# Altium schematic sheet [02]-IC.SchDoc: ENTER SHEET TITLE
size B; Engineer: ENTER ENGINEER NAME; Organization: CUAir; Address1: L3, 12a Rodborough Rd; Address2: Frenchs Forest; Address3: NSW; Address4: Australia 2086; Revision: ENTER REVISION NUMBER; CompetitionYear: 2019; CPN: ENTER CPN; PROJECT: ENTER PROJECT NAME
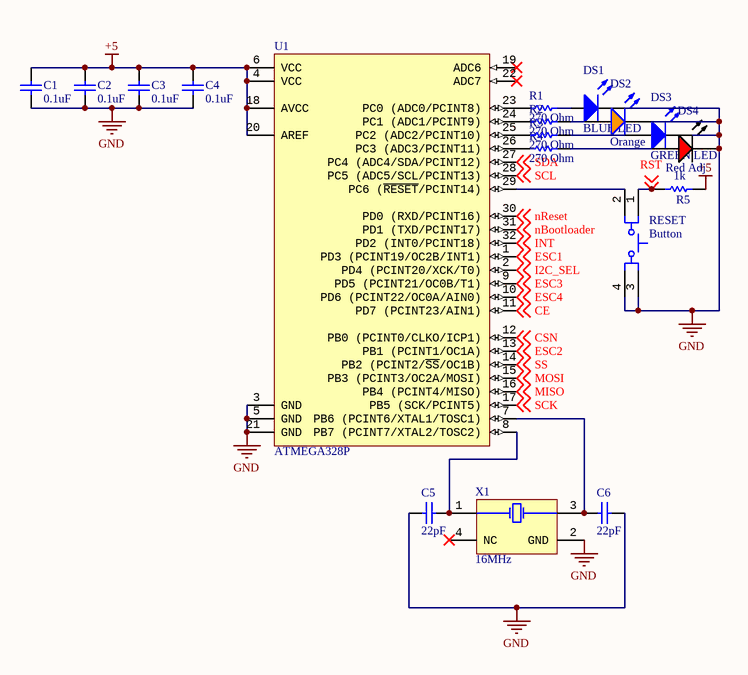
[diagram p0: [02]-IC.SchDoc]

## Parts
C1  0.1uF  [CAPC2013X70X50ML10T25]
C2  0.1uF  [CAPC2013X70X50ML10T25]
C3  0.1uF  [CAPC2013X70X50ML10T25]
C4  0.1uF  [CAPC2013X70X50ML10T25]
C5  22pF  [CAPC1608X90X40ML10T20]
C6  22pF  [CAPC1608X90X40ML10T20]
DS1  BLUE LED  [0805_A]
DS2  Orange  [LTST-C171AKT_V]
DS3  GREEN LED  [LITE-ON-LTST-C191KRKT-2_V]
DS4  Red Adj  [LTST-C170KRKT_V]
R1  270 Ohm  [RESC2013X50X40NL20T20]
R2  270 Ohm  [RESC2013X50X40NL20T20]
R3  270 Ohm  [RESC2013X50X40NL20T20]
R4  270 Ohm  [RESC2013X50X40NL20T20]
R5  1k  [RESC1005X40X25NL05T10]
RESET  Button  [CKCP-PTS645S_V]
U1  ATMEGA328P  [32A_M]
X1  16MHz  [AVX-CX2520DB_V]

## Nets
+5: C1.2 C2.2 C3.2 C4.2 R5.1 U1.4(VCC) U1.6(VCC) U1.18(AVCC) U1.20(AREF)
GND: C1.1 C2.1 C3.1 C4.1 C5.1 C6.2 DS1.1(K) DS2.2(K) DS3.2(K) DS4.2(K) RESET.3 RESET.4 U1.3(GND) U1.5(GND) U1.21(GND) X1.2(GND)
CE: U1.11(PD7_(PCINT23/AIN1)) ; off-sheet CE
CSN: U1.12(PB0_(PCINT0/CLKO/ICP1)) ; off-sheet CSN
ESC1: U1.1(PD3_(PCINT19/OC2B/INT1)) ; off-sheet ESC1
ESC2: U1.13(PB1_(PCINT1/OC1A)) ; off-sheet ESC2
ESC3: U1.9(PD5_(PCINT21/OC0B/T1)) ; off-sheet ESC3
ESC4: U1.10(PD6_(PCINT22/OC0A/AIN0)) ; off-sheet ESC4
I2C_SEL: U1.2(PD4_(PCINT20/XCK/T0)) ; off-sheet I2C_SEL
INT: U1.32(PD2_(INT0/PCINT18)) ; off-sheet INT
MISO: U1.16(PB4_(PCINT4/MISO)) ; off-sheet MISO
MOSI: U1.15(PB3_(PCINT3/OC2A/MOSI)) ; off-sheet MOSI
nBootloader: U1.31(PD1_(TXD/PCINT17)) ; off-sheet nBootloader
nReset: U1.30(PD0_(RXD/PCINT16)) ; off-sheet nReset
RST: R5.2 RESET.1 ; off-sheet RST
SCK: U1.17(PB5_(SCK/PCINT5)) ; off-sheet SCK
SCL: U1.28(PC5_(ADC5/SCL/PCINT13)) ; off-sheet SCL
SDA: U1.27(PC4_(ADC4/SDA/PCINT12)) ; off-sheet SDA
SS: U1.14(PB2_(PCINT2/~{SS}/OC1B)) ; off-sheet SS
NetC5_2: C5.2 U1.8(PB7_(PCINT7/XTAL2/TOSC2)) X1.1(HOT)
NetC6_1: C6.1 U1.7(PB6_(PCINT6/XTAL1/TOSC1)) X1.3(HOT)
NetDS1_2: DS1.2(A) R1.2
NetDS2_1: DS2.1(A) R2.2
NetDS3_1: DS3.1(A) R3.2
NetDS4_1: DS4.1(A) R4.2
NetR1_1: R1.1 U1.23(PC0_(ADC0/PCINT8))
NetR2_1: R2.1 U1.24(PC1_(ADC1/PCINT9))
NetR3_1: R3.1 U1.25(PC2_(ADC2/PCINT10))
NetR4_1: R4.1 U1.26(PC3_(ADC3/PCINT11))
NetRESET_2: RESET.2 U1.29(PC6_(~{RESET}/PCINT14))

Not connected (* = marked no-connect by the designer): U1 19(ADC6)* 22(ADC7)*; X1 4(NC)*

## Notes on the sheet
- Project
- Title
- Size:
- Date:
- B
- Number:
- Revision:
- File:

## Library data of the parts
C1-C4 = CMP-2000-05001-1: Chip Capacitor, 0.1 uF, -20% to 80%, 50 V, -30 to 85 degC, 0805 (2012 Metric), RoHS, Tape and Reel; Manufacturer: Yageo; MPN: CC0805ZRY5V9BB104; Capacitance: 0.1µF; Catalog Drawings: CC_0805_0.6; Featured Product: CommodityMultilayerCeramicCapacitors–CCSeries; Other Names: 311-1361-6; Tolerance: -20%,+80%; Voltage - Rated: 50V; Temperature Coefficient: Y5V(F); Online Catalog: CCSeries; Features: -; Operating Temperature: -30degC~85degC; Packaging: Digi-Reel; Height - Seated (Max): -; Category: Capacitors; Lead Spacing: -; Mounting Type: SurfaceMount,MLCC; Lead Style: -; Datasheet Version: Rev. 5, 07/2010; Series: CC; Manufacturer URL: http://www.yageo.com/; Package Reference: 0805 (2012 Metric); Package Description: 2-Pin Surface Mount Device, Body 2 x 1.25 mm; Ratings: -; Applications: GeneralPurpose; Family: CeramicCapacitors; Package / Case: 0805(2012Metric); Datasheet URL: http://download.siliconexpert.com/pdfs/2012/8/14/1/40/50/201/yageo_/manual/upy-gphc_y5v_6.3v-to-50v_5_revised.pdf; Standard Package: 1; Value: 0.1uF
C5 C6 = CMP-1659-00006-3: Chip Capacitor, 22 pF, +/- 5%, 50 V, -55 to 125 degC, 0603 (1608 Metric), RoHS, Tape and Reel; MPN: CC0603JRNP09BN220; Manufacturer: Yageo; Mount: Surface Mount; PackageReference: 0603; DatasheetVersion: Rev. 13, 05/2016; RoHSCompliant: true; PackageDescription: 2-Pin Surface Mount Device, Body 1.6 x 0.8 mm; Min Operating Temperature: -55 degC; Length: 1.6 mm; Mounting Technology: Surface Mount; Max Operating Temperature: 125 degC; Value: 22pF
DS1 = CMP-1426-00008-1: SMD mono-color Chip LED, WL-SMCW, Blue; Manufacturer: Wuerth Elektronik; PartNumber: 150080BS75000; Color: Blue; ComponentLink2URL: http://katalog.we-online.com/led/datasheet/150080BS75000.pdf; ComponentLink1URL: http://www.we-online.com; ComponentLink2Description: Datasheet; PackageReference: 0805_A; ComponentLink1Description: Manufacturer URL
DS2 = CMP-1674-00004-5: LED Uni-Color Orange, 100 mW, 120 mA, -55 to 85 degC, 2-Pin SMD, RoHS, Tape and Reel; Manufacturer: Lite-On; MPN: LTST-C171AKT; ComponentLink1URL: http://www.us.liteon.com/; ComponentLink2Description: Datasheet; Packaging: Tape and Reel; Mount: Surface Mount; RoHSCompliant: true; Colour: Orange; Min Operating Temperature: -55 degC; ComponentLink2URL: http://optoelectronics.liteon.com/upload/download/DS-22-99-0170/S_110_LTST-C171AKT.pdf; Package Quantity: 3000; Height: 0.8 mm; Max Operating Temperature: 85 degC; ComponentLink1Description: Manufacturer URL; PackageReference: C171AKT; PackageDescription: 2-Pin Surface Mount Device, Body 2 x 1.25 mm; DatasheetVersion: 03/2014; Length: 2 mm; Mounting Technology: Surface Mount; Pins: 2
DS3 = CMP-2000-05198-1: Chip LED, Green, 574 nm, 40 pF, -55 to 85 degC, 2-Pin SMD, RoHS, Tape and Reel; Manufacturer: Lite-On; MPN: LTST-C191KGKT; Rad Hardened: No; Emitting Color: YellowGreen; Product Height (mm): 0.55mm; Forward Voltage: 2.4V; Number of Elements: 1; Dominant Wave Length: 571nm; DELETED: Compliant; Viewing Angle: 130deg; High Brightness: Yes; Peak Wavelength: 574nm; Type: Uni-Color; Forward Current: 30mA; Product Length (mm): 1.6mm; Luminous Intensity: 35mcd; Test Current (It): 20mA; Chip Material: AlGaInP; Product Depth (mm): 0.8mm; Shape Type: Rectangular; Reverse Voltage: 5V; Power Dissipation: 75W; Pin Count: 2; Lens Dimensions: 1.1X0.8X0.37mm; Packaging: TapeandReel; Main Category: ChipLED; Operating Temperature Classification: Industrial; Package Type: ChipLed; Mounting: SurfaceMount; Lum Intensity: 35mcd; Operating Temp Range: -55Cto85C; Datasheet Version: Jan-07; Datasheet URL: http://download.siliconexpert.com/pdfs/2007/08/26/semi_b/manual/lot/ds/ltst-c191kgkt.pdf; Manufacturer URL: http://www.us.liteon.com/
DS4 = CMP-2000-07593-1: LED Red, 75 mW, 54 mcd, -55 to 85 degC, 2-Pin SMD, RoHS, Tape and Reel; Manufacturer: Lite-On; Lens Transparency: Clear; Number of Elements: 1; Power Rating: 75mW; Luminous Intensity: 54mcd; Viewing Angle: 130degrees; Forward Current: 30mA; Wavelength: 639nm; Lens Style: Rectangular; Case\/Package: 0805; Test Current: 20mA; Dominant Wavelength: 631nm; Forward Voltage: 2V; Lens Colour: Colorless; Min Operating Temperature: -55degC; RoHSCompliant: True; Length: 3.2mm; Width: 1.25mm; Mount: SurfaceMount; Packaging: TapeandReel; Number of LEDs: 1; Radiation Hardening: No; Datasheet URL: http://optoelectronics.liteon.com/upload/download/DS-22-99-0150/LTST-C170KRKT.pdf; Datasheet Version: Rev. D, 11/2014; Case Code (Metric): 2012; Height: 1.1mm; Number of Pins: 2; Package Description: 2-Pin Surface Mount Device, Body 2 x 1.25 mm; Manufacturer URL: http://www.us.liteon.com/; Lead Free: LeadFree; Illumination Colour: Red; Colour: Red; Case Code (Imperial): 0805; Max Operating Temperature: 85degC; Power Dissipation: 75mW; Mounting Technology: SurfaceMount; Package Reference: C170KRKT; Package Quantity: 1; Depth: 1.6mm
R1-R4 = CMP-2001-03354-1: 270 Ohm Resistor; Part Number: RR1220P-271-D; Manufacturer: Susumu; Value: 270 Ohm
R5 = CMP-2002-07472-1: MPN: RC0402FR-071KL; Manufacturer: Yageo / Phycomp; Value: 1k
RESET = CMP-2000-07594-1: Tact Switch, SPST-NO, 50 mA, -20 to 60 degC, 4-Pin SMD, RoHS, Tape and Reel; Manufacturer: C&K Components; MPN: PTS645SM43SMTR92 LFS; Actuator Length: 0.85mm; Voltage Rating (DC): 12V; Mechanical Life: 100000Cycles; Illumination Type: Illuminated; Throw Configuration: SPST; Switch Function: Off-Mom; Actuator Material: Polyamide; Contact Resistance: 100mOhm; Max Current Rating: 50mA; Operating Force: 160gf; Case\/Package: SMD/SMT; Orientation: Straight; RoHSCompliant: True; Manufacturer URL: http://www.ckswitches.com/; Package Quantity: 1000; Datasheet URL: http://www.ckswitches.com/media/1471/pts645.pdf; Colour: Black; Min Operating Temperature: -20degC; Length: 6mm; Mount: SurfaceMount; Depth: 9mm; Max Voltage Rating (DC): 12V; Package Reference: PTS645S; REACH SVHC: NoSVHC; Contact Material: Silver; Packaging: TapeandReel; Package Description: 4-Pin Surface Mount Device, Body 6 x 6 mm, Pitch 4.5 mm; Max Operating Temperature: 60degC; Lead Free: LeadFree; Termination: GullWing; Current Rating: 50mA; Datasheet Version: 04/2016; Mounting Technology: SurfaceMount; Contact Plating: Silver; Value: Button
U1 = CMP-0095-00269-2: 8-bit AVR Microcontroller, 32KB Flash, 1KB EEPROM, 2KB SRAM, 32-pin TQFP, Industrial Grade (-40°C to 85°C); MPN: ATmega328P-AU; Manufacturer: Microchip Technology; PackageDescription: 32-Lead, 7x7x1.0 mm Body, 0.8mm Lead Pitch, Thin Profile Plastic Quad Flat Package (TQFP); DatasheetVersion: revD, May-2011; RevisionNote: DatasheetVersion & PackageVersion updated. URLs added.; ComponentLink1URL: http://www.atmel.com/; ComponentLink2Description: ATmega48A/48PA/88A/88PA/168A/168PA/328/328P Datasheet; Code_JEDEC: MS-026-ABA; ComponentLink1Description: Manufacturer URL; PackageReference: 32A; ComponentLink3Description: ATmega48A/48PA/88A/88PA/168A/168PA/328/328P Summary; ComponentLink2URL: http://www.atmel.com/dyn/resources/prod_documents/doc8271.pdf; PackageVersion: revC, Oct-2010; ComponentLink3URL: http://www.atmel.com/dyn/resources/prod_documents/8271S.pdf; Value: ATMEGA328P
X1 = CMP-2000-06128-1: Crystal, 16 MHz, 8 pF, -10 to 70 degC, 4-Pin SMD, RoHS, Tape and Reel; Manufacturer: AVX; MPN: CX2520DB16000D0GEJCC; ESR: 80Ohms; Frequency Stability: 15PPM; Load Capacitance: 8pF; Unit Weight: 0.000459oz; Qualification: AEC-Q200; Drive Level: 10uW; Brand: AVX/Kyocera; Manufacturer URL: http://global.kyocera.com/; Factory Pack Quantity: 3000; Length: 2.5mm; Frequency: 16MHz; Package Reference: CX2520DB; Product Category: Crystals; Width: 2mm; Mounting Technology: SurfaceMount; Packaging: Reel; Termination Style: SMD/SMT; Mounting Style: SMD/SMT; RoHS: True; Package Description: 4-Pin Surface Mount Device, Body 2.5 x 2 mm, Pitch 1.7 mm; Datasheet URL: http://www.kyocera-crystal.jp/eng/wp-content/uploads/2014/12/cx2520db_e.pdf; Datasheet Version: 09/2015; Package / Case: 2.5mmx2mm; Height: 0.5mm; Tolerance: 15PPM; Type: SMDCrystal; Series: CX2520DB; Operating Temperature Range: -10Cto+70C; Value: 16MHz